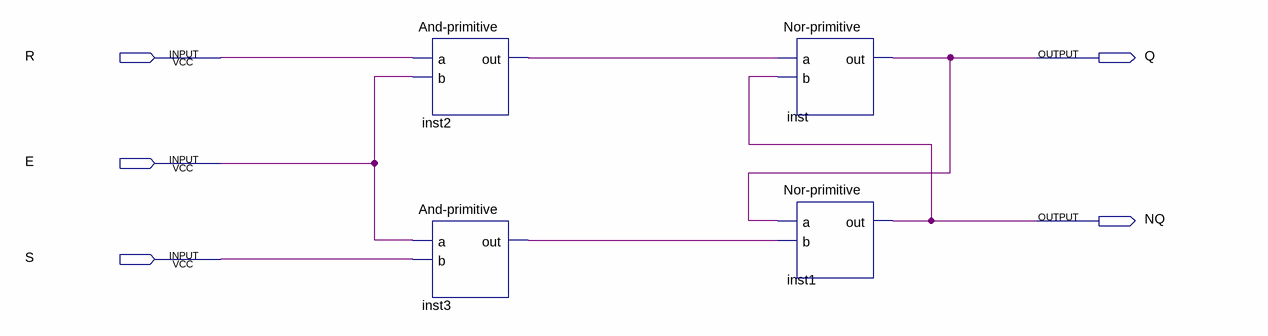
[diagram p0: schematic sheet]
// Quartus schematic GatedSRLatch.bdf as structural Verilog: 4 symbols, 5 pins
module GatedSRLatch (
  input  R,
  input  E,
  input  S,
  output Q,
  output NQ
);

  wire inst2_out, inst3_out;

  \And-primitive  inst2 (.a(R), .b(E), .out(inst2_out));
  \And-primitive  inst3 (.a(E), .b(S), .out(inst3_out));
  \Nor-primitive  inst (.a(inst2_out), .b(NQ), .out(Q));
  \Nor-primitive  inst1 (.a(Q), .b(inst3_out), .out(NQ));
endmodule
